# EasyEDA Pro project 25工创PCB.eprj, schematic Schematic1
Board Name: 显示板v2; Create Date: 2025-04-03; Page Name: P1; Project Name: 25工创PCB; Schematic Name: Schematic1; Update Date: 2025-04-03; Company: 嘉立创EDA; Page Size: A4; Version: V1.0
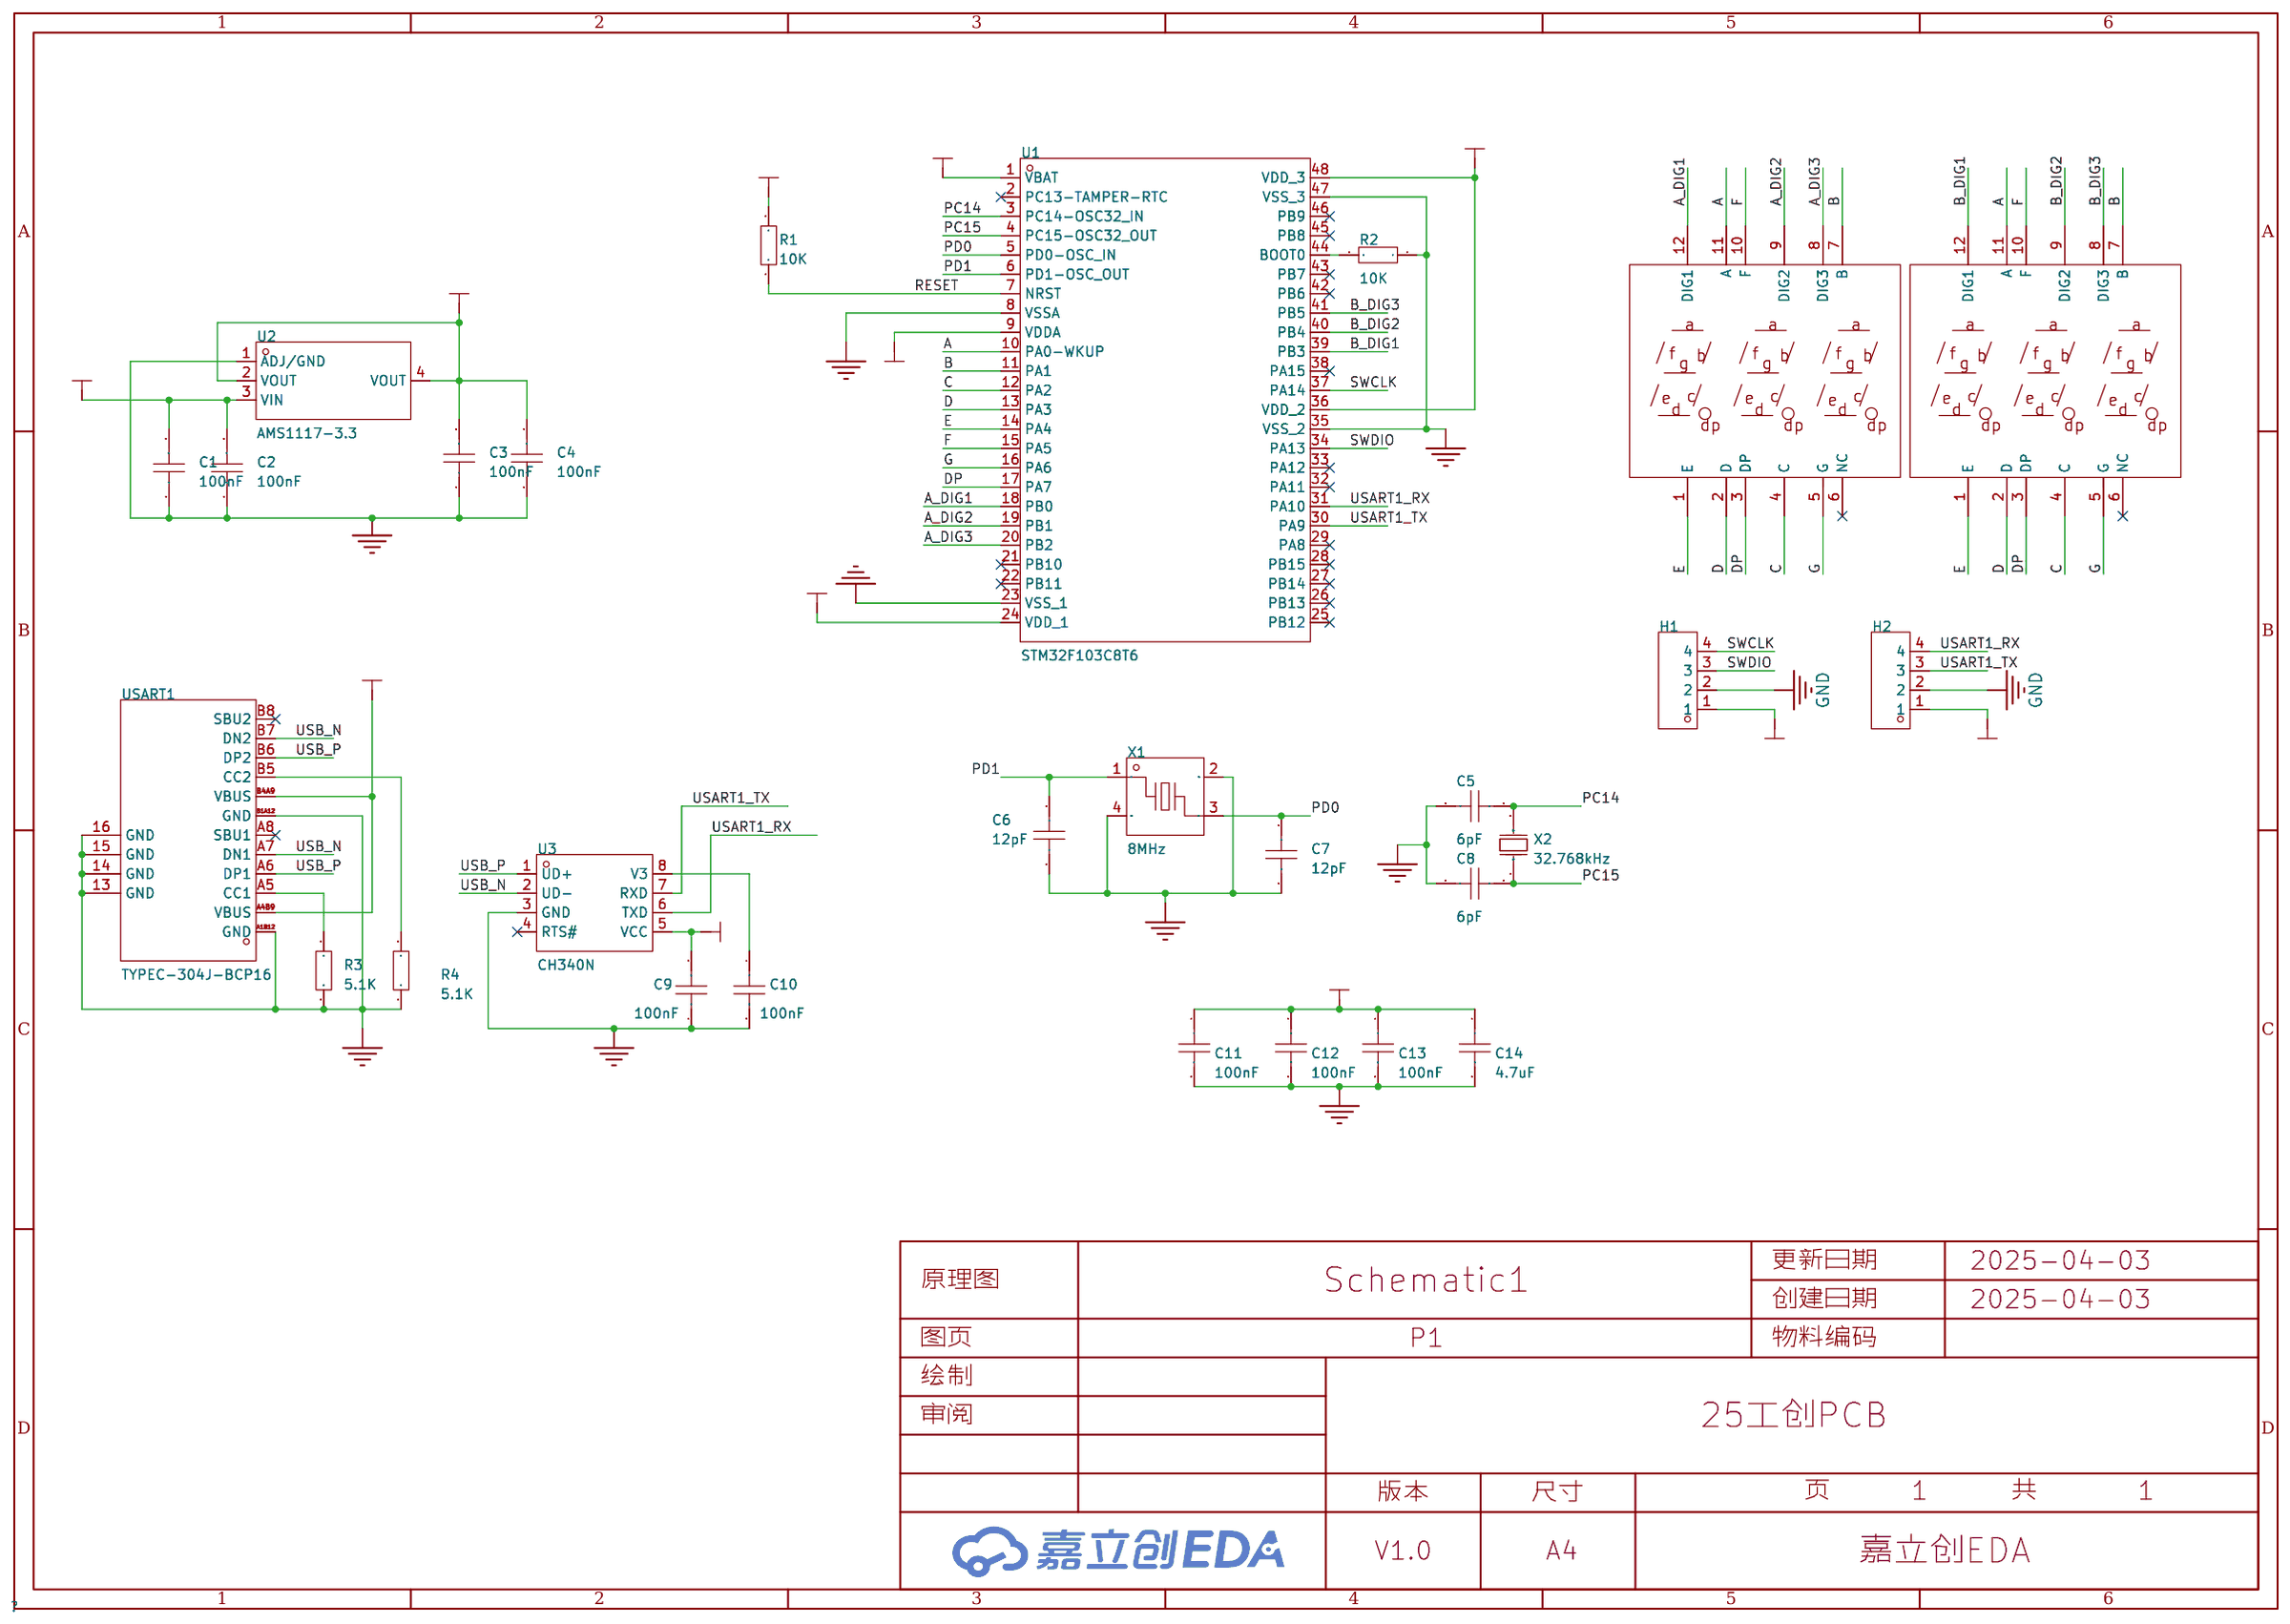
[diagram p7: schematic sheet]

## Parts
C1  100nF  [C0603]
C2  100nF  [C0603]
C3  100nF  [C0603]
C4  100nF  [C0603]
C5  100nF  [C0603]
C6  100nF  [C0603]
C7  100nF  [C0603]
C8  100nF  [C0603]
C9  100nF  [C0603]
C10  100nF  [C0603]
C11  100nF  [C0603]
C12  100nF  [C0603]
C13  100nF  [C0603]
C14  100nF  [C0603]
H1  PZ254V-11-04P  [HDR-TH_4P-P2.54-V-M]
H2  PZ254V-11-04P  [HDR-TH_4P-P2.54-V-M]
LED1  SP420361N  [LED-SEG-TH_SP420361N]
LED2  SP420361N  [LED-SEG-TH_SP420361N]
R1  10K  [R0603]
R2  10K  [R0603]
R3  5.1K  [R0603]
R4  5.1K  [R0603]
U1  STM32F103C8T6  [LQFP-48_L7.0-W7.0-P0.50-LS9.0-BL]
U2  AMS1117-3.3  [SOT-223_L6.5-W3.5-P2.30-LS7.0-BR]
U3  CH340N  [SOP-8_L4.9-W3.9-P1.27-LS6.0-BL]
USART1  TYPEC-304J-BCP16  [USB-C-SMD_TYPEC-304J-BCP16]
X1  30MHz  [smd-3225_4p_l3.2-w2.5]
X2  32.768kHz  [crystal-smd_l3.2-w1.5_rt3215]

## Library data of the parts
C1-C14 = CAP_0603: Supplier Footprint: 0603
H1 H2 = PZ254V-11-04P: 插针结构:1x4P;间距:2.54mm;行距:-;圆针/方针:方针;安装类型:直插;排数:单排;总PIN位数:4P;额定电流:3A;额定电压:250V;配合针长度:6mm;塑高:2.5mm;端接针长度:3mm;触头材质:-;工作温度范围:-40℃~+105℃;颜色:黑色;; LCSC Part Name: 间距:2.54mm 1x4P 直插 方针; Supplier Part: C2691448; Manufacturer: XFCN(兴飞); Supplier Footprint: 插件,P=2.54mm; JLCPCB Part Class: 扩展库; Datasheet: https://atta.szlcsc.com/upload/public/pdf/source/20200309/C492403_F9F19131791D08044AD4F84F8E751A34.pdf; Supplier: LCSC; Pin Structure: 1x4P; Pitch: 2.54mm; Circluar Pins/Square Pins: 方针; Mounting Type: 直插; Number of Rows: 单排; Number of Pins: 4P; Current Rating (Max): 3A; Voltage Rating (Max): 250V; Length of Mating Pin: 6mm; Insulation Height: 2.5mm; Length of End Connection Pin: 3mm; Operating Temperature Range: -40℃~+105℃; Color: 黑色
LED1 LED2 = SP420361N: 数码管位数:3位;发光颜色:红色;LED极性:共阴极;数字/字母大小(英寸):0.36;; LCSC Part Name: 3位0.36英寸红色数码管 共阴极; Supplier Part: C98927; Manufacturer: ARKLED(方舟); Supplier Footprint: 插件; JLCPCB Part Class: 扩展库; Datasheet: https://atta.szlcsc.com/upload/public/pdf/source/20170713/C98927_1499918920582816853.pdf; Supplier: LCSC; Number of Characters: 3位; Luminous Color: 红色; LED Polarity: 共阴极; Digit/Alpha Size(inch): 0.36
R1-R4 = Res_0603: Supplier Footprint: 0603
U1 = STM32F103C8T6: LCSC Part Name: 主流增强型ARM Cortex-M3 MCU，具有64 KB Flash、72 MHz CPU、电机控制、USB和CAN; Supplier Part: C8734; Manufacturer: ST(意法半导体); Supplier Footprint: LQFP-48(7x7); JLCPCB Part Class: 扩展库; Datasheet: https://atta.szlcsc.com/upload/public/pdf/source/20220812/8363ACEC51AD55ECEB84799464F7CB85.pdf; Supplier: LCSC; CPU Core: ARM-M3; CPU Maximum Speed: 72MHz; Program Storage Size: 64KB; Program Memory Type: FLASH; Number of I/O: 37; ADC (Bit): 12bit; Low Voltage Detection Threshold: 2V~3.6V
U2 = AMS1117-3.3_C426566: 输出类型:固定;输出极性:正;输出通道数:1;最大输入电压:18V;输出电压:3.3V;压差:1.4V@(1A);输出电流:1A;电源纹波抑制比(PSRR):70dB@(120Hz);; LCSC Part Name: 正 Vin=18V Vout=3.3V 1A 70dB@(120Hz); Supplier Part: C426566; Manufacturer: Slkor(萨科微); Supplier Footprint: SOT-223; JLCPCB Part Class: Extended Part; Datasheet: https://atta.szlcsc.com/upload/public/pdf/source/20201231/C426566_7F22DB93439D00F3FA27143E4F28C6AA.pdf; Supplier: LCSC; Output Type: 固定; Output Polarity: 正; Number of Outputs: 1; Maximum Input Voltage: 18V; Output Voltage: 3.3V; Dropout Voltage: 1.4V@(1A); Output Current: 1A; Power Supply Rejection Ratio (PSRR): 70dB@(120Hz)
U3 = CH340N: LCSC Part Name: USB转串口芯片 CH340; Supplier Part: C2977777; Manufacturer: WCH(南京沁恒); Supplier Footprint: SOP-8; JLCPCB Part Class: 扩展库; Datasheet: https://atta.szlcsc.com/upload/public/pdf/source/20230530/6E401E9554E9F5311886CC8B3F89B62E.pdf; Supplier: LCSC
USART1 = TYPEC-304J-BCP16: 连接器类型:Type-C;标准:USB 3.1;公母:母;触点数量:16P;端口数量:1;安装方式:卧贴;额定电流 - 电源:5A;工作温度范围:-40℃~+85℃;焊接温度(最大值):260℃;; LCSC Part Name: Type-C 母 卧贴 脚长2.0; Supplier Part: C2835315; Manufacturer: XUNPU(讯普); Supplier Footprint: SMD; JLCPCB Part Class: 扩展库; Datasheet: https://atta.szlcsc.com/upload/public/pdf/source/20210528/C2835315_A76BD3CF9329D12B6041421AD23BFD66.pdf; Supplier: LCSC; Connector Type: Type-C; Standard: USB 3.1; Gender: 母; Number of Contacts: 16P; Number of Ports: 1; Mounting Style: 卧贴; Current Rating - Power (Max): 5A; Operating Temperature Range: -40℃~+85℃; Welding Temperature (Max): 260℃
X1 = ABM11-30.000MHZ-D2X-T3: 频率:30MHz;频率公差:±20ppm;负载电容:10pF;; LCSC Part Name: 30MHz ±20ppm 10pF; Supplier Part: C1985560; Manufacturer: ABRACON; Supplier Footprint: SMD-4P; JLCPCB Part Class: Extended Part; Datasheet: https://atta.szlcsc.com/upload/public/pdf/source/20210425/8AC92399DDF972ACE4511AFF33D75394.pdf; Supplier: LCSC; Frequency Tolerance: ±20ppm; Frequency Stability: ±20ppm; Load Capacitance: 10pF; Equivalent Series Resistance (ESR): 80Ω; Operating Temperature: -40~+85
X2 = 贴片晶振32.768KHz12.5PF20ppm封装:1610-2P: Supplier Part: C9900012694; Supplier Footprint: SMD-1610-2P; JLCPCB Part Class: Extended Part; Datasheet: https://atta.szlcsc.comnull; Supplier: LCSC

## Nets
3V3: C3.2 C4.1 C9.2 C11.1 C12.1 C13.1 C14.1 H1.1 R1.2 U1.1(VBAT) U1.9(VDDA) U1.24(VDD_1) U1.36(VDD_2) U1.48(VDD_3) U2.2(VOUT) U2.4(VOUT) U3.5(VCC)
5V: C1.2 C2.2 H2.1 U2.3(VIN) USART1.A4B9(VBUS) USART1.B4A9(VBUS)
GND: C1.1 C2.1 C3.1 C4.2 C5.2 C6.1 C7.1 C8.2 C9.1 C10.2 C11.2 C12.2 C13.2 C14.2 H1.2 H2.2 R2.1 R3.2 R4.1 U1.8(VSSA) U1.23(VSS_1) U1.35(VSS_2) U1.47(VSS_3) U2.1(ADJ/GND) U3.3(GND) USART1.13(GND) USART1.14(GND) USART1.15(GND) USART1.16(GND) USART1.A1B12(GND) USART1.B1A12(GND) X1.2(GND) X1.4(GND)
A: LED1.11(A) LED2.11(A) U1.10(PA0-WKUP)
A_DIG1: LED1.12(DIG1) U1.18(PB0)
A_DIG2: LED1.9(DIG2) U1.19(PB1)
A_DIG3: LED1.8(DIG3) U1.20(PB2)
B: LED1.7(B) LED2.7(B) U1.11(PA1)
B_DIG1: LED2.12(DIG1) U1.39(PB3)
B_DIG2: LED2.9(DIG2) U1.40(PB4)
B_DIG3: LED2.8(DIG3) U1.41(PB5)
C: LED1.4(C) LED2.4(C) U1.12(PA2)
D: LED1.2(D) LED2.2(D) U1.13(PA3)
DP: LED1.3(DP) LED2.3(DP) U1.17(PA7)
E: LED1.1(E) LED2.1(E) U1.14(PA4)
F: LED1.10(F) LED2.10(F) U1.15(PA5)
G: LED1.5(G) LED2.5(G) U1.16(PA6)
PC14: C5.1 U1.3(PC14-OSC32_IN) X2.2(OSC2)
PC15: C8.1 U1.4(PC15-OSC32_OUT) X2.1(OSC1)
PD0: C7.2 U1.5(PD0-OSC_IN) X1.3(OUT)
PD1: C6.2 U1.6(PD1-OSC_OUT) X1.1(IN)
RESET: R1.1 U1.7(NRST)
SWCLK: H1.4 U1.37(PA14)
SWDIO: H1.3 U1.34(PA13)
USART1_RX: H2.4 U1.31(PA10) U3.6(TXD)
USART1_TX: H2.3 U1.30(PA9) U3.7(RXD)
USB_N: U3.2(UD-) USART1.A7(DN1) USART1.B7(DN2)
USB_P: U3.1(UD+) USART1.A6(DP1) USART1.B6(DP2)
$1N958: R3.1 USART1.A5(CC1)
$1N959: R4.2 USART1.B5(CC2)
$1N973: C10.1 U3.8(V3)
$1N992: R2.2 U1.44(BOOT0)

Not connected (* = marked no-connect by the designer): LED1 6(NC)*; LED2 6(NC)*; U1 2(PC13-TAMPER-RTC)* 21(PB10)* 22(PB11)* 25(PB12)* 26(PB13)* 27(PB14)* 28(PB15)* 29(PA8)* 32(PA11)* 33(PA12)* 38(PA15)* 42(PB6)* 43(PB7)* 45(PB8)* 46(PB9)*; U3 4(RTS#)*; USART1 A8(SBU1)* B8(SBU2)*
